# EAGLE design FlightControl (EAGLE 6.5.0)
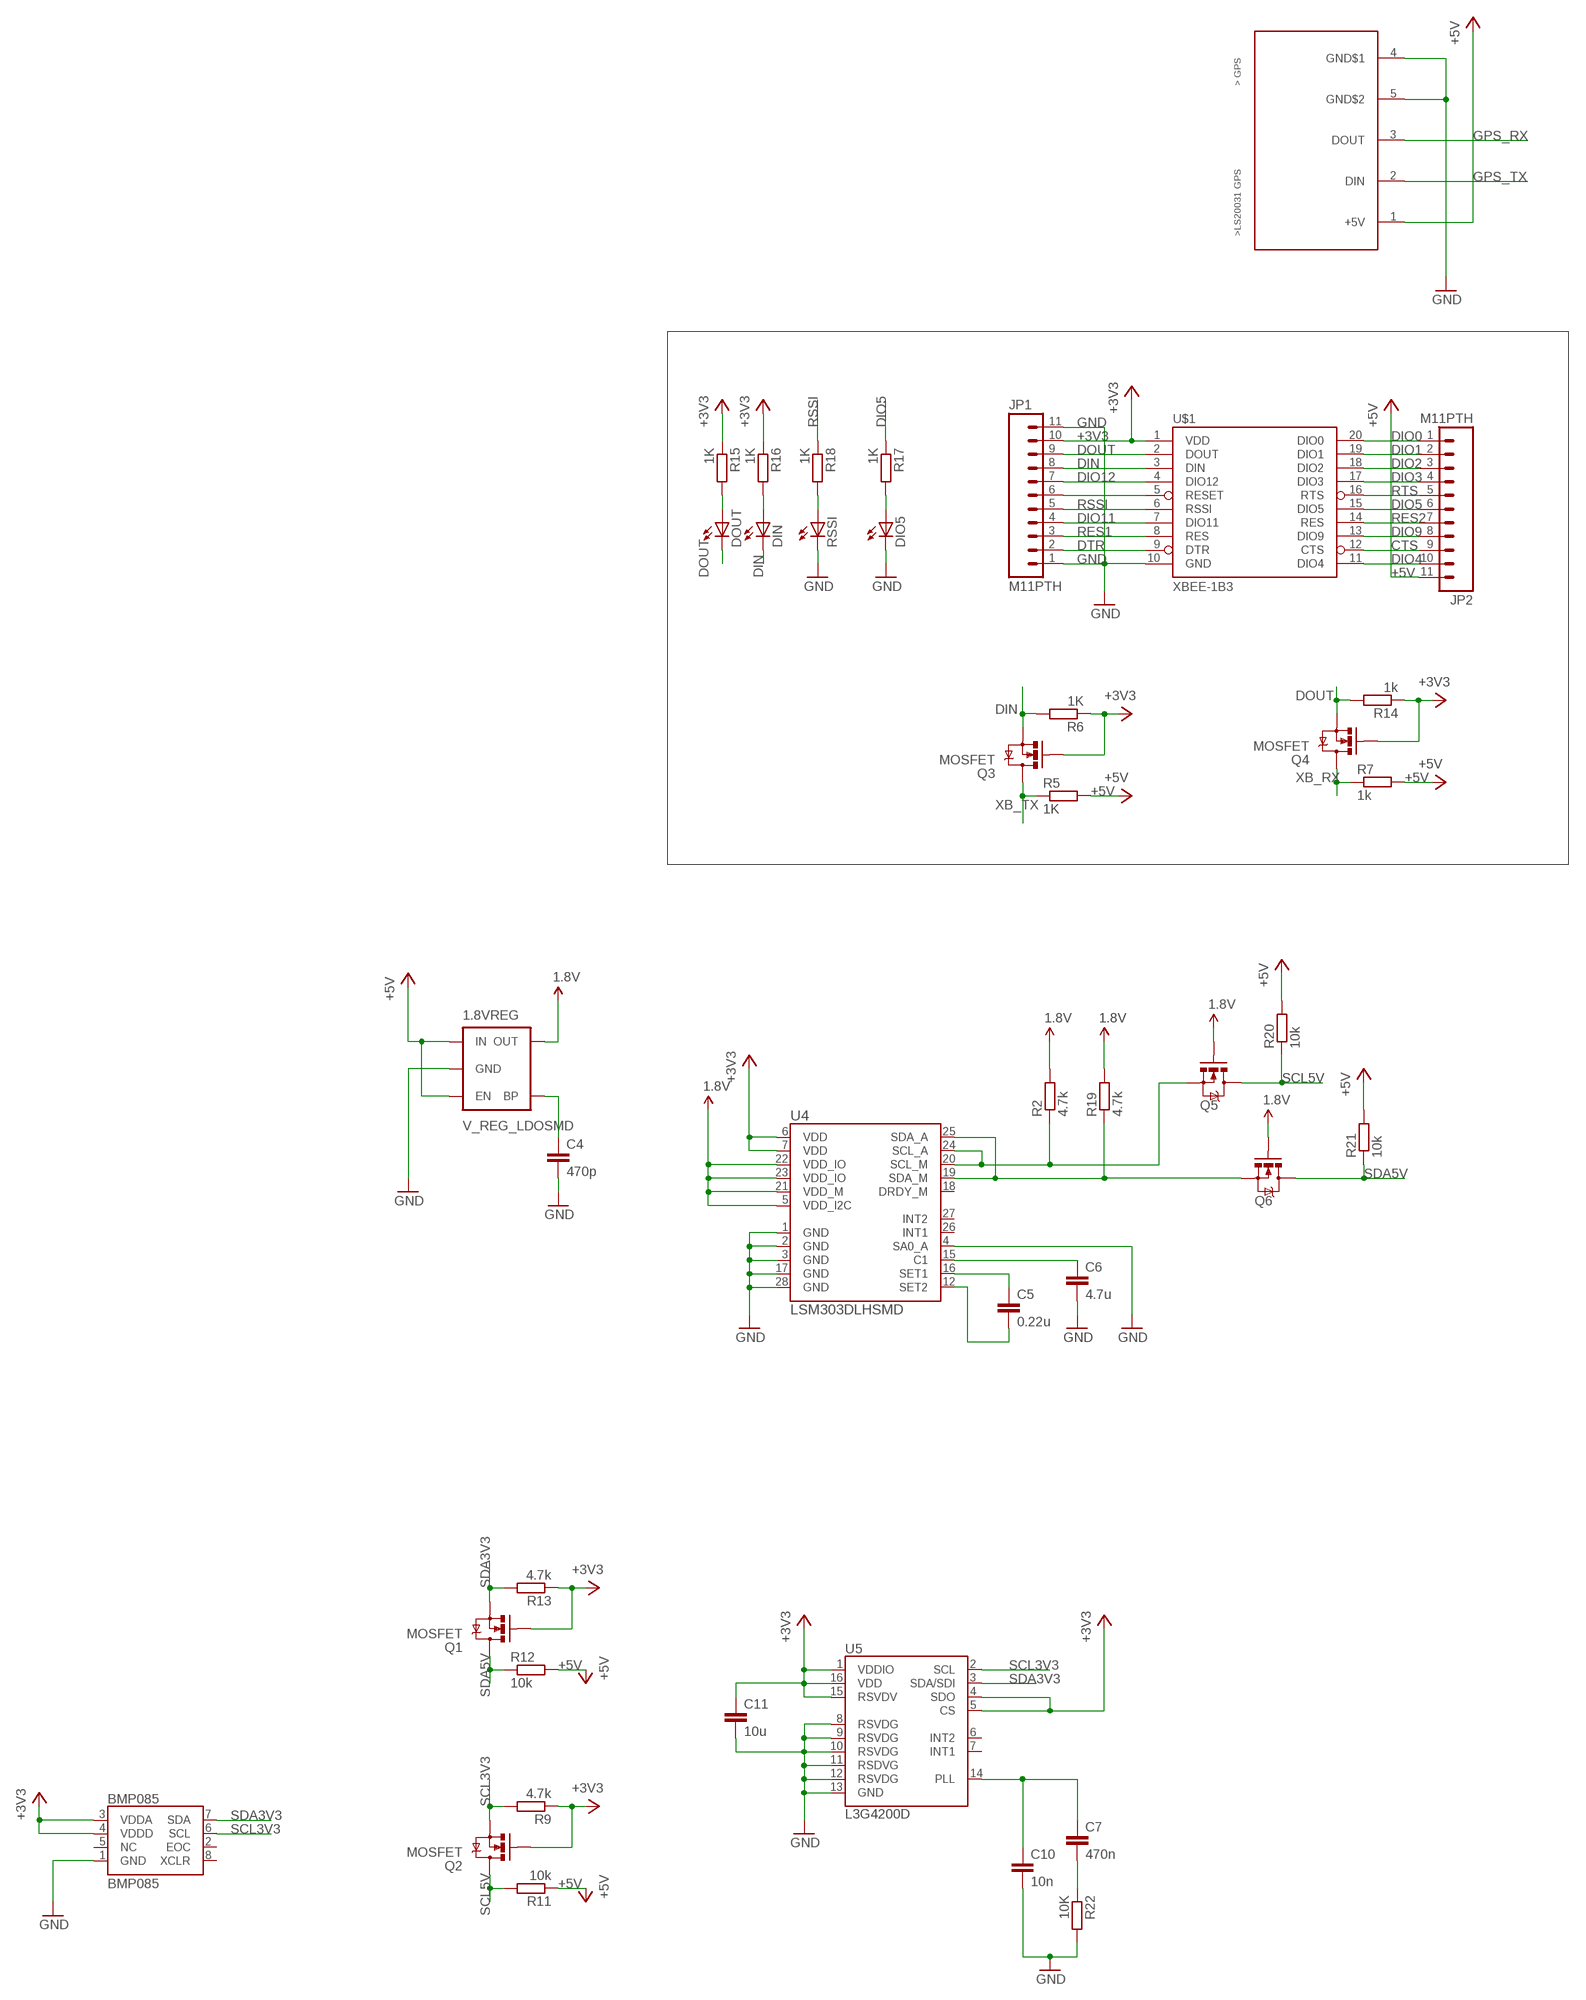
[diagram p0: schematic, sheet 1, part 1 of 2]
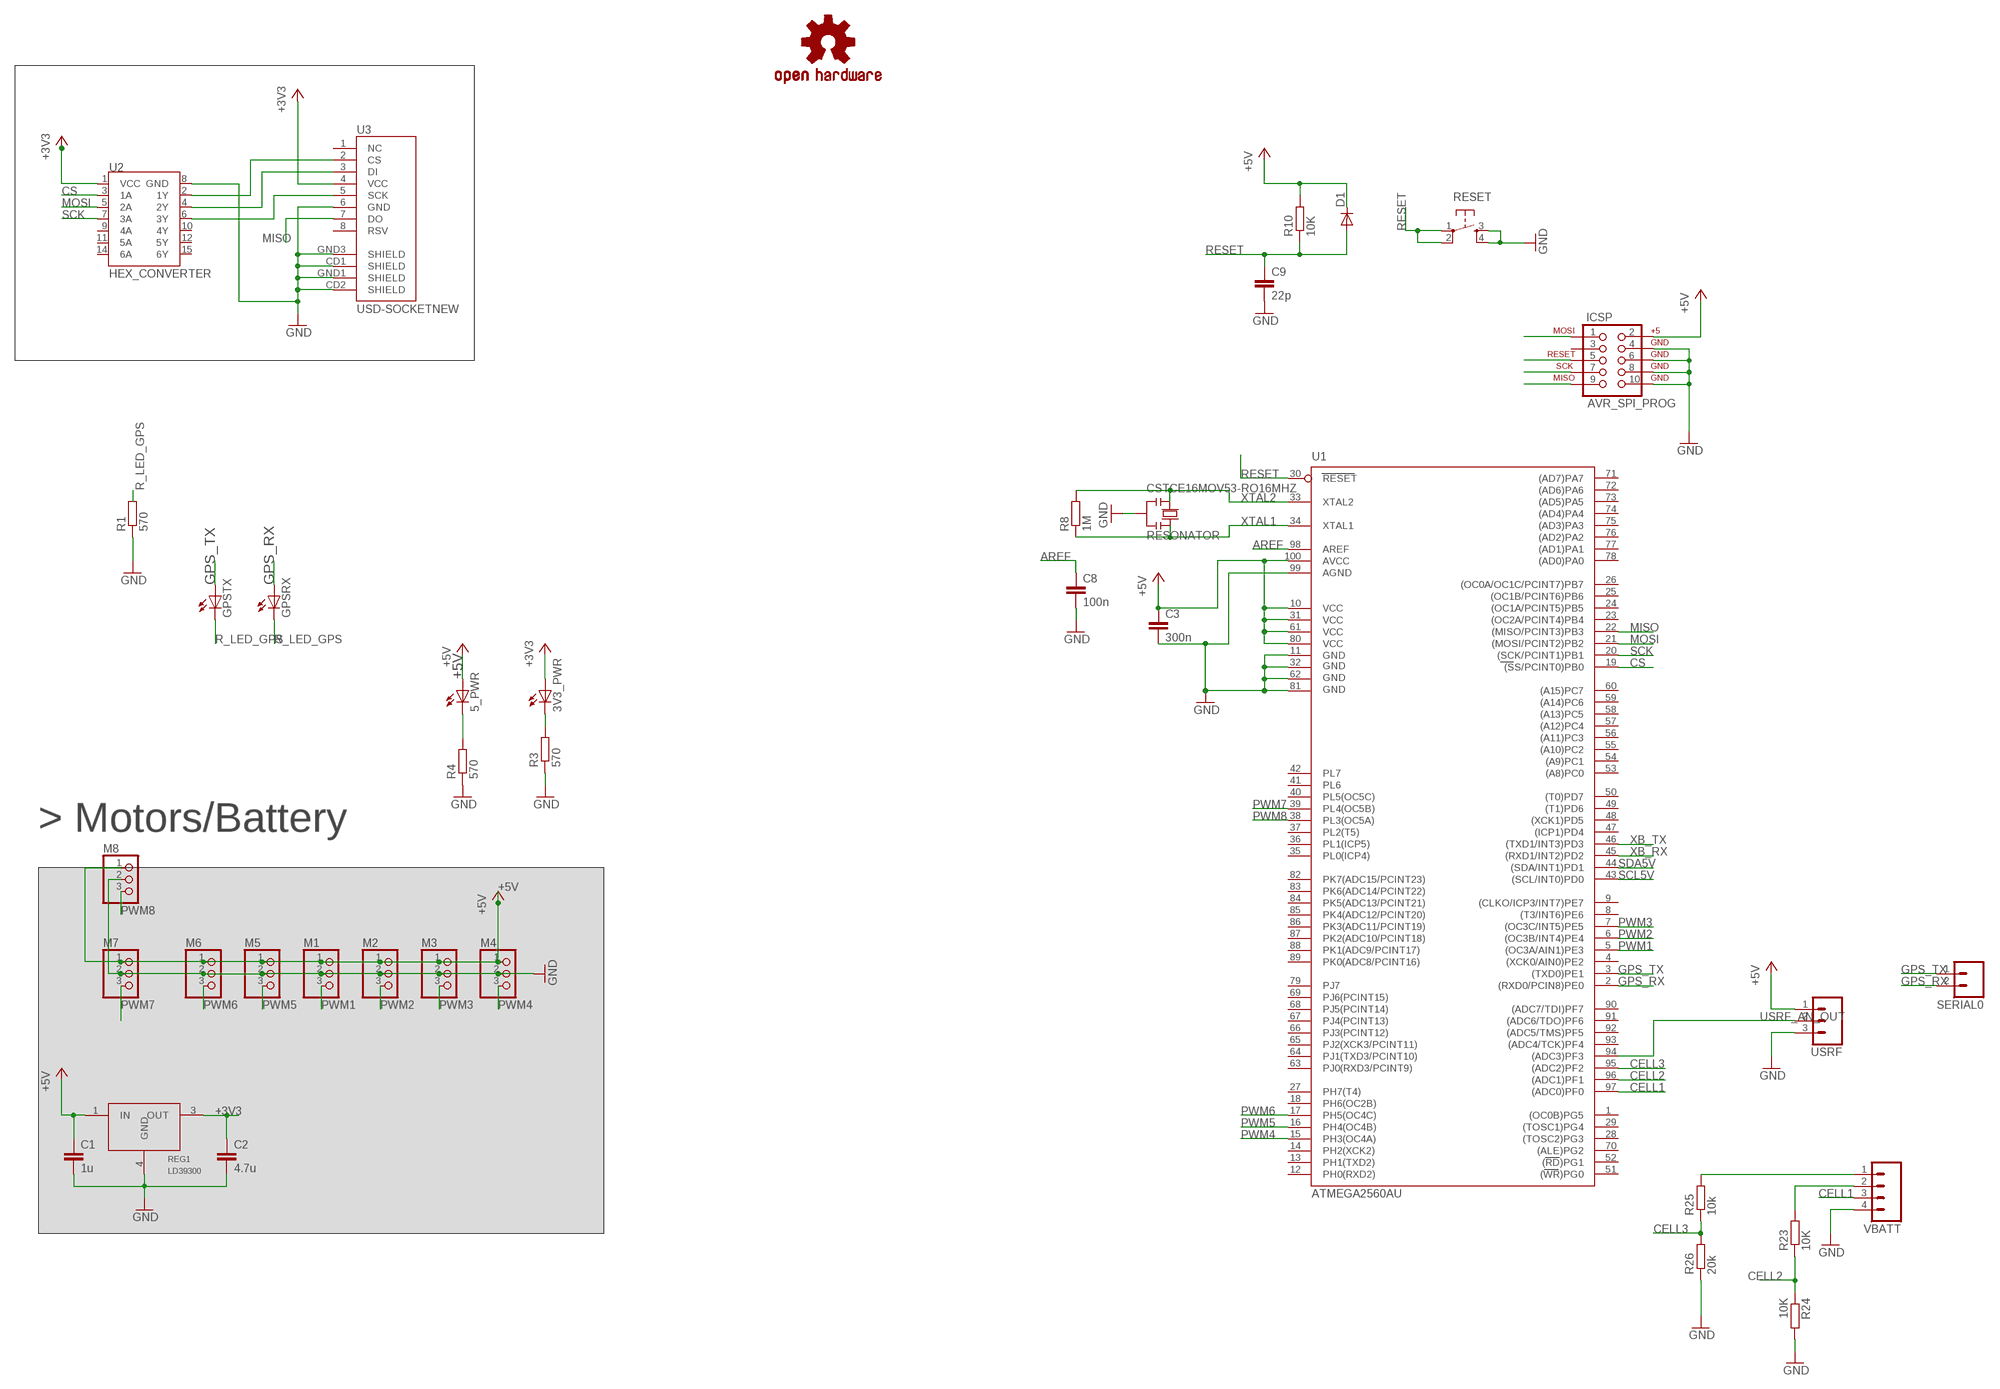
[diagram p1: schematic, sheet 1, part 2 of 2]

## Parts
1.8VREG  V_REG_LDOSMD  [SOT23-5]
3V3_PWR  LEDCHIPLED_1206  [CHIPLED_1206]
5_PWR  LEDCHIPLED_1206  [CHIPLED_1206]
BMP085  BMP085  [BMP085]
C1  1u  C-EUC3216  [C3216]
C2  4.7u  C-EUC3216  [C3216]
C3  300n  C-EUC3216  [C3216]
C4  470p  C-EUC3216  [C3216]
C5  0.22u  C-EUC3216  [C3216]
C6  4.7u  C-EUC3216  [C3216]
C7  470n  C-EUC3216  [C3216]
C8  100n  C-EUC3216  [C3216]
C9  22p  C-EUC3216  [C3216]
C10  10n  C-EUC3216  [C3216]
C11  10u  C-EUC3216  [C3216]
CSTCE16MOV53-RO16MHZ  RESONATOR  RESONATORMU  [RESONATOR]
D1  DIODE-MINIMELF  [MINIMELF]
DIN  LEDCHIPLED_1206  [CHIPLED_1206]
DIO5  LEDCHIPLED_1206  [CHIPLED_1206]
DOUT  LEDCHIPLED_1206  [CHIPLED_1206]
GPSRX  LEDCHIPLED_1206  [CHIPLED_1206]
GPSTX  LEDCHIPLED_1206  [CHIPLED_1206]
ICSP  AVR_SPI_PROG  [AVR_ICSP]
JP1  M11PTH  [1X11]
JP2  M11PTH  [1X11]
LOGO1  OSHW-LOGOL  [OSHW-LOGO-L]
M1  PINHD-1X3  [1X03]
M2  PINHD-1X3  [1X03]
M3  PINHD-1X3  [1X03]
M4  PINHD-1X3  [1X03]
M5  PINHD-1X3  [1X03]
M6  PINHD-1X3  [1X03]
M7  PINHD-1X3  [1X03]
M8  PINHD-1X3  [1X03]
Q1  MOSFET  MOSFET-NCHANNELBSS138  [SOT23]
Q2  MOSFET  MOSFET-NCHANNELBSS138  [SOT23]
Q3  MOSFET  MOSFET-NCHANNELBSS138  [SOT23]
Q4  MOSFET  MOSFET-NCHANNELBSS138  [SOT23]
Q5  MOSFET  MOSFET-NCHANNELBSS138  [SOT23]
Q6  MOSFET  MOSFET-NCHANNELBSS138  [SOT23]
R1  570  R-EU_R1206  [R1206]
R2  4.7k  R-EU_R1206  [R1206]
R3  570  R-EU_R1206  [R1206]
R4  570  R-EU_R1206  [R1206]
R5  1K  R-EU_R1206  [R1206]
R6  1K  R-EU_R1206  [R1206]
R7  1k  R-EU_R1206  [R1206]
R8  1M  R-EU_R1206  [R1206]
R9  4.7k  R-EU_R1206  [R1206]
R10  10K  R-EU_R1206  [R1206]
R11  10k  R-EU_R1206  [R1206]
R12  10k  R-EU_R1206  [R1206]
R13  4.7k  R-EU_R1206  [R1206]
R14  1k  R-EU_R1206  [R1206]
R15  1K  R-EU_R1206  [R1206]
R16  1K  R-EU_R1206  [R1206]
R17  1K  R-EU_R1206  [R1206]
R18  1K  R-EU_R1206  [R1206]
R19  4.7k  R-EU_R1206  [R1206]
R20  10k  R-EU_R1206  [R1206]
R21  10k  R-EU_R1206  [R1206]
R22  10K  R-EU_R1206  [R1206]
R23  10K  R-EU_R1206  [R1206]
R24  10K  R-EU_R1206  [R1206]
R25  10k  R-EU_R1206  [R1206]
R26  20k  R-EU_R1206  [R1206]
REG1  LD39300  [DPAK]
RESET  TAC_SWITCHPTH  [TACTILE-PTH]
RSSI  LEDCHIPLED_1206  [CHIPLED_1206]
SERIAL0  M02LOCK_LONGPADS  [1X02_LOCK_LONGPADS]
U1  ATMEGA2560AU  [TQFP100]
U2  HEX_CONVERTER  [SO016]
U3  USD-SOCKETNEW  [MICRO-SD-SOCKET-PP]
U4  LSM303DLHSMD  [LGA28-5X5]
U5  L3G4200D  [LGA16-4X4]
U$1  XBEE-1B3  [XBEE-SMD]
U$2  LS20031  [LS20031]
USRF  M03LONGPADS  [1X03_LONGPADS]
VBATT  M04LONGPADS  [1X04_LONGPADS]

## Nets
1.8V: 1.8VREG.5(OUT) Q5.1(G) Q6.1(G) R2.2 R19.2 U4.5(VDD_I2C) U4.21(VDD_M) U4.22(VDD_IO) U4.23(VDD_IO)
+3V3: 3V3_PWR.A BMP085.3(VDDA) BMP085.4(VDDD) C2.1 C11.1 JP1.10 Q1.1(G) Q2.1(G) Q3.1(G) Q4.1(G) R6.1 R9.1 R13.1 R14.1 R15.1 R16.1 REG1.3(OUT) U2.1(VCC) U3.4(VCC) U4.6(VDD) U4.7(VDD) U5.1(VDDIO) U5.4(SDO) U5.5(CS) U5.15(RSVDV) U5.16(VDD) U$1.1(VDD)
+5V: 1.8VREG.1(IN) 1.8VREG.3(EN) 5_PWR.A C1.1 C3.1 D1.C ICSP.2 JP2.11 M1.1 M2.1 M3.1 M4.1 M5.1 M6.1 M7.1 M8.1 R5.2 R7.2 R10.2 R11.1 R12.2 R20.2 R21.2 REG1.1(IN) U1.10(VCC) U1.31(VCC1) U1.61(VCC2) U1.80(VCC3) U1.100(AVCC) U$2.1(+5V) USRF.1
AREF: C8.1 U1.98(AREF)
CELL1: U1.97((ADC0)PF0) VBATT.3
CELL2: R23.1 R24.1 U1.96((ADC1)PF1)
CELL3: R25.1 R26.2 U1.95((ADC2)PF2)
CS: U1.19((SS/PCINT0)PB0) U2.3(1A)
CTS: JP2.9 U$1.12(CTS)
DIN: DIN.C JP1.8 Q3.2(S) R6.2 U$1.3(DIN)
DIO0: JP2.1 U$1.20(DIO0)
DIO1: JP2.2 U$1.19(DIO1)
DIO2: JP2.3 U$1.18(DIO2)
DIO3: JP2.4 U$1.17(DIO3)
DIO4: JP2.10 U$1.11(DIO4)
DIO5: JP2.6 R17.1 U$1.15(DIO5)
DIO9: JP2.8 U$1.13(DIO9)
DIO11: JP1.4 U$1.7(DIO11)
DIO12: JP1.7 U$1.4(DIO12)
DOUT: DOUT.C JP1.9 Q4.2(S) R14.2 U$1.2(DOUT)
DTR: JP1.2 U$1.9(DTR)
GND: 1.8VREG.2(GND) BMP085.1(GND) C1.2 C2.2 C3.2 C4.2 C6.2 C8.2 C9.2 C10.2 C11.2 CSTCE16MOV53-RO16MHZ.2 DIO5.C ICSP.4 ICSP.6 ICSP.8 ICSP.10 JP1.1 JP1.11 M1.2 M2.2 M3.2 M4.2 M5.2 M6.2 M7.2 M8.2 R1.1 R3.1 R4.1 R22.2 R24.2 R26.1 REG1.4(GND) RESET.3 RESET.4 RSSI.C U1.11(GND) U1.32(GND1) U1.62(GND2) U1.81(GND3) U1.99(AGND) U2.8(GND) U3.6(GND) U3.CD1(SHIELD) U3.CD2(SHIELD) U3.GND1(SHIELD) U3.GND3(SHIELD) U4.1(GND) U4.2(GND) U4.3(GND) U4.4(SA0_A) U4.17(GND) U4.28(GND) U5.8(RSVDG) U5.9(RSVDG) U5.10(RSVDG) U5.11(RSDVG) U5.12(RSVDG) U5.13(GND) U$1.10(GND) U$2.4(GND$1) U$2.5(GND$2) USRF.3 VBATT.4
GPS_RX: GPSRX.A SERIAL0.2 U1.2((RXD0/PCIN8)PE0) U$2.3(DOUT)
GPS_TX: GPSTX.A SERIAL0.1 U1.3((TXD0)PE1) U$2.2(DIN)
MISO: ICSP.9 U1.22((MISO/PCINT3)PB3) U3.7(DO)
MOSI: ICSP.1 U1.21((MOSI/PCINT2)PB2) U2.5(2A)
N$1: 3V3_PWR.C R3.2
N$2: 1.8VREG.4(BP) C4.1
N$3: U2.2(1Y) U3.2(CS)
N$4: U2.4(2Y) U3.3(DI)
N$5: U2.6(3Y) U3.5(SCK)
N$6: C5.1 U4.16(SET1)
N$7: 5_PWR.C R4.2
N$8: DIO5.A R17.2
N$9: R18.2 RSSI.A
N$10: DIN.A R16.2
N$11: DOUT.A R15.2
N$12: JP1.6 U$1.5(RESET)
N$13: C5.2 U4.12(SET2)
N$14: C6.1 U4.15(C1)
N$16: Q5.2(S) R2.1 U4.20(SCL_M) U4.24(SCL_A)
N$17: Q6.2(S) R19.1 U4.19(SDA_M) U4.25(SDA_A)
N$18: R23.2 VBATT.2
N$19: C7.1 C10.1 U5.14(PLL)
N$20: C7.2 R22.1
N$21: R25.2 VBATT.1
PWM1: M1.3 U1.5((OC3A/AIN1)PE3)
PWM2: M2.3 U1.6((OC3B/INT4)PE4)
PWM3: M3.3 U1.7((OC3C/INT5)PE5)
PWM4: M4.3 U1.15(PH3(OC4A))
PWM5: M5.3 U1.16(PH4(OC4B))
PWM6: M6.3 U1.17(PH5(OC4C))
PWM7: M7.3 U1.39(PL4(OC5B))
PWM8: M8.3 U1.38(PL3(OC5A))
R_LED_GPS: GPSRX.C GPSTX.C R1.2
RES1: JP1.3 U$1.8(RES)
RES2: JP2.7 U$1.14(RES)
RESET: C9.1 D1.A ICSP.5 R10.1 RESET.1 RESET.2 U1.30(RESET)
RSSI: JP1.5 R18.1 U$1.6(RSSI)
RTS: JP2.5 U$1.16(RTS)
SCK: ICSP.7 U1.20((SCK/PCINT1)PB1) U2.7(3A)
SCL3V3: BMP085.6(SCL) Q2.2(S) R9.2 U5.2(SCL)
SCL5V: Q2.3(D) Q5.3(D) R11.2 R20.1 U1.43((SCL/INT0)PD0)
SDA3V3: BMP085.7(SDA) Q1.2(S) R13.2 U5.3(SDA/SDI)
SDA5V: Q1.3(D) Q6.3(D) R12.1 R21.1 U1.44((SDA/INT1)PD1)
USRF_AN_OUT: U1.94((ADC3)PF3) USRF.2
XB_RX: Q4.3(D) R7.1 U1.45((RXD1/INT2)PD2)
XB_TX: Q3.3(D) R5.1 U1.46((TXD1/INT3)PD3)
XTAL1: CSTCE16MOV53-RO16MHZ.3 R8.1 U1.34(XTAL1)
XTAL2: CSTCE16MOV53-RO16MHZ.1 R8.2 U1.33(XTAL2)
Unconnected: BMP085.2(EOC) BMP085.5(NC) BMP085.8(XCLR) ICSP.3 U1.1((OC0B)PG5) U1.4((XCK0/AIN0)PE2) U1.8((T3/INT6)PE6) U1.9((CLKO/ICP3/INT7)PE7) U1.12(PH0(RXD2)) U1.13(PH1(TXD2)) U1.14(PH2(XCK2)) U1.18(PH6(OC2B)) U1.23((OC2A/PCINT4)PB4) U1.24((OC1A/PCINT5)PB5) U1.25((OC1B/PCINT6)PB6) U1.26((OC0A/OC1C/PCINT7)PB7) U1.27(PH7(T4)) U1.28((TOSC2)PG3) U1.29((TOSC1)PG4) U1.35(PL0(ICP4)) U1.36(PL1(ICP5)) U1.37(PL2(T5)) U1.40(PL5(OC5C)) U1.41(PL6) U1.42(PL7) U1.47((ICP1)PD4) U1.48((XCK1)PD5) U1.49((T1)PD6) U1.50((T0)PD7) U1.51((WR)PG0) U1.52((RD)PG1) U1.53((A8)PC0) U1.54((A9)PC1) U1.55((A10)PC2) U1.56((A11)PC3) U1.57((A12)PC4) U1.58((A13)PC5) U1.59((A14)PC6) U1.60((A15)PC7) U1.63(PJ0(RXD3/PCINT9)) U1.64(PJ1(TXD3/PCINT10)) U1.65(PJ2(XCK3/PCINT11)) U1.66(PJ3(PCINT12)) U1.67(PJ4(PCINT13)) U1.68(PJ5(PCINT14)) U1.69(PJ6(PCINT15)) U1.70((ALE)PG2) U1.71((AD7)PA7) U1.72((AD6)PA6) U1.73((AD5)PA5) U1.74((AD4)PA4) U1.75((AD3)PA3) U1.76((AD2)PA2) U1.77((AD1)PA1) U1.78((AD0)PA0) U1.79(PJ7) U1.82(PK7(ADC15/PCINT23)) U1.83(PK6(ADC14/PCINT22)) U1.84(PK5(ADC13/PCINT21)) U1.85(PK4(ADC12/PCINT20)) U1.86(PK3(ADC11/PCINT19)) U1.87(PK2(ADC10/PCINT18)) U1.88(PK1(ADC9/PCINT17)) U1.89(PK0(ADC8/PCINT16)) U1.90((ADC7/TDI)PF7) U1.91((ADC6/TDO)PF6) U1.92((ADC5/TMS)PF5) U1.93((ADC4/TCK)PF4) U2.9(4A) U2.10(4Y) U2.11(5A) U2.12(5Y) U2.14(6A) U2.15(6Y) U3.1(NC) U3.8(RSV) U4.18(DRDY_M) U4.26(INT1) U4.27(INT2) U5.6(INT2) U5.7(INT1)

## Notes on the sheet
- > Motors/Battery

## Library data of the parts
1.8VREG = SparkFun-PowerIC:V_REG_LDO: Voltage Regulator LDO Standard 150mA LDO voltage regulator in SOT-23 layout. Micrel part MIC5205. BP (by-pass) pin is used to lower output noise with 470pF cap.
3V3_PWR 5_PWR DIN DIO5 DOUT GPSRX GPSTX RSSI = adafruit:LED: LED OSRAM: - CHIPLED LG R971, LG N971, LY N971, LG Q971, LY Q971, LO R971, LY R971 LH N974, LH R974 LS Q976, LO Q976, LY Q976 LO Q996 - Hyper CHIPLED LW Q18S LB Q993, LB Q99A, LB R99A - SideLED LS A670, LO A670, LY A670, LG A670, LP A670 LB A673, LV A673, LT A673, LW A673 LH A674 LY A675 LS A676, LA A676, LO A676, LY A676, LW A676 LS A679, LY A679, LG A679 - Hyper Micro SIDELED® LS Y876, LA Y876, LO Y876, LY Y876 LT Y87S - SmartLED LW L88C, LW L88S LB L89C, LB L89S, LG L890 LS L89K, LO L89K, LY L89K LS L896, LA L896, LO L896, LY L896 - TOPLED LS T670, LO T670, LY T670, LG T670, LP T670 LSG T670, LSP T670, LSY T670, LOP T670, LYG T670 LG T671, LOG T671, LSG T671 LB T673, LV T673, LT T673, LW T673 LH T674 LS T676, LA T676, LO T676, LY T676, LB T676, LH T676, LSB T676, LW T676 LB T67C, LV T67C, LT T67C, LS T67K, LO T67K, LY T67K, LW E67C LS E67B, LA E67B, LO E67B, LY E67B, LB E67C, LV E67C, LT E67C LW T67C LS T679, LY T679, LG T679 LS T770, LO T770, LY T770, LG T770, LP T770 LB T773, LV T773, LT T773, LW T773 LH T774 LS E675, LA E675, LY E675, LS T675 LS T776, LA T776, LO T776, LY T776, LB T776 LHGB T686 LT T68C, LB T68C - Hyper Mini TOPLED® LB M676 - Mini TOPLED Santana® LG M470 LS M47K, LO M47K, LY M47K Source: http://www.osram.convergy.de/
BMP085 = SparkFun:BMP085: BMP085 Pressure Sensor Great little MEMS pressure sensor. SKU: COM-09603
C1-C11 = rcl:C-EU: CAPACITOR, European symbol
CSTCE16MOV53-RO16MHZ = SmartPrj:RESONATOR
D1 = diode:DIODE-: DIODE
ICSP = SparkFun-Connectors:AVR_SPI_PROG: AVR 10-pin ICSP Header This is the standard AVR In Circuit Serial Programming header. Minimal, but includes pin one indicator. Works with standard Olimex programmers. Also look for the 6-pin reduced version. Spark Fun Electronics SKU: PRT-00778
JP1 JP2 = SparkFun-Connectors:M11: Header 11 Standard 11-pin 0.1" header. Use with straight break away headers (SKU : PRT-00116), right angle break away headers (PRT-00553), swiss pins (PRT-00743), machine pins (PRT-00117), and female headers (PRT-00115).
LOGO1 = SparkFun-Aesthetics:OSHW-LOGO: Open Source Hardware Logo This logo indicates the piece of hardware it is found on incorporates a OSHW license and/or adheres to the definition of open source hardware found here: http://freedomdefined.org/OSHW
M1-M8 = pinhead:PINHD-1X3: PIN HEADER
Q1-Q6 = SparkFun-DiscreteSemi:MOSFET-NCHANNEL: Common NMOSFET Parts MFG P/N Store ID Prod ID FDD8780 TRANS-09984 SI7820DN TRANS-11055 FDS6630A IC-08089 2N7002PW TRANS-11151 FQP30N06L COM-10213 TRANS-10060 BSS123LT1G TRANS-08345 BSS138 TRANS-00830 BS170 2N7000; PROD_ID: TRANS-00830
R1-R26 = SmartPrj:R-EU_: RESISTOR, European symbol
REG1 = v-reg:LD39300
RESET = SparkFun-Electromechanical:TAC_SWITCH: Momentary Switch Button commonly used for reset or general input. Spark Fun Electronics SKU : COM-00097 SMT- SWCH-08247
SERIAL0 = SparkFun-Connectors:M02: Standard 2-pin 0.1" header. Use with - straight break away headers ( PRT-00116) - right angle break away headers (PRT-00553) - swiss pins (PRT-00743) - machine pins (PRT-00117) - female headers (PRT-00115) Molex polarized connector foot print use with: PRT-08233 with associated crimp pins and housings. 2.54_SCREWTERM for use with PRT-10571. 3.5mm Screw Terminal footprints for PRT-08084 5mm Screw Terminal footprints for use with PRT-08433
U1 = SparkFun-DigitalIC:ATMEGA2560: Atmel 100-pin 8-bit uC 64/128/256 Kbytes FLASH 4 Kbytes EEPROM 8 Kbytes SRAM 86 General Purpose I/O pins 12-channels16-bit PWM 4 x Serial USARTs 16-channels 10-bit A/D
U2 = SparkFun-DigitalIC:HEX_CONVERTER: Just what it says.
U3 = SparkFun-Connectors:USD-SOCKET: microSD Socket Push-push type uSD socket. Schematic element and footprint production proven. Spark Fun Electronics SKU : PRT-00127. tDoc lines correctly indicate media card edge positions when inserting (unlocked, locked, depressed).
U4 = SparkFun-Sensors:LSM303DLH: I2C accelerometer/magnetometer/tilt compensated compass
U5 = SparkFun-Sensors:L3G4200D: L3G4200D Three-axis, digital output gyroscope The L3G4200D is a low-power three-axis angular rate sensor, has a full scale of ±250/±500/±2000 dps and is capable of measuring rates with a user-selectable bandwidth. It includes a sensing element and an IC interface capable of providing the measured angular rate to the external world through a digital interface (I2C/SPI). Package: 4x4x1.1 LGA-16 (LGA16-4x4.PAC)
U$1 = SparkFun-RF:XBEE-1: Xbee module footprints SMT header is CONN-09042.; PROD_ID: CONN-09042
U$2 = MyLib:LS20031
USRF = SparkFun-Connectors:M03: Header 3 Standard 3-pin 0.1" header. Use with straight break away headers (SKU : PRT-00116), right angle break away headers (PRT-00553), swiss pins (PRT-00743), machine pins (PRT-00117), and female headers (PRT-00115). Molex polarized connector foot print use with SKU : PRT-08232 with associated crimp pins and housings.
VBATT = SparkFun-Connectors:M04: Header 4 Standard 4-pin 0.1" header. Use with straight break away headers (SKU : PRT-00116), right angle break away headers (PRT-00553), swiss pins (PRT-00743), machine pins (PRT-00117), and female headers (PRT-00115). Molex polarized connector foot print use with SKU : PRT-08231 with associated crimp pins and housings. 1MM SMD Version SKU: PRT-10208

## Net classes
0 default: clearance 0.205 mm

## Board
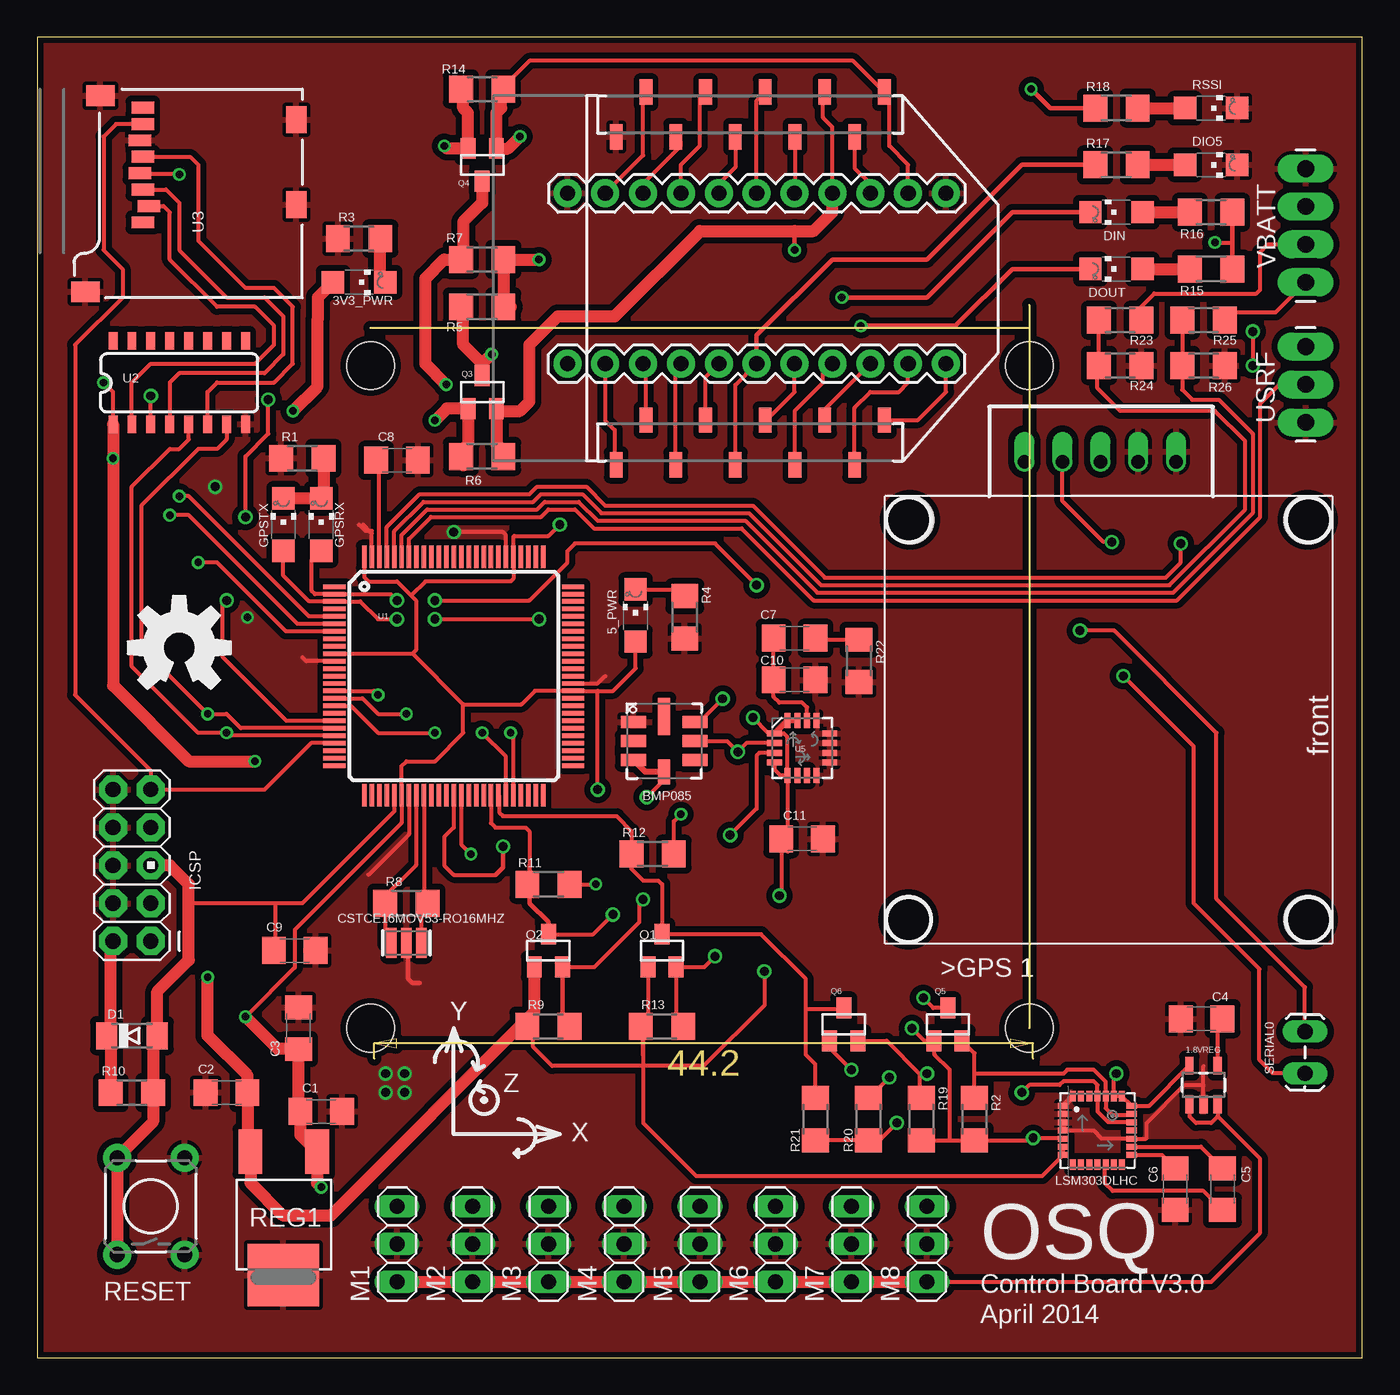
[diagram p2: board, top side]
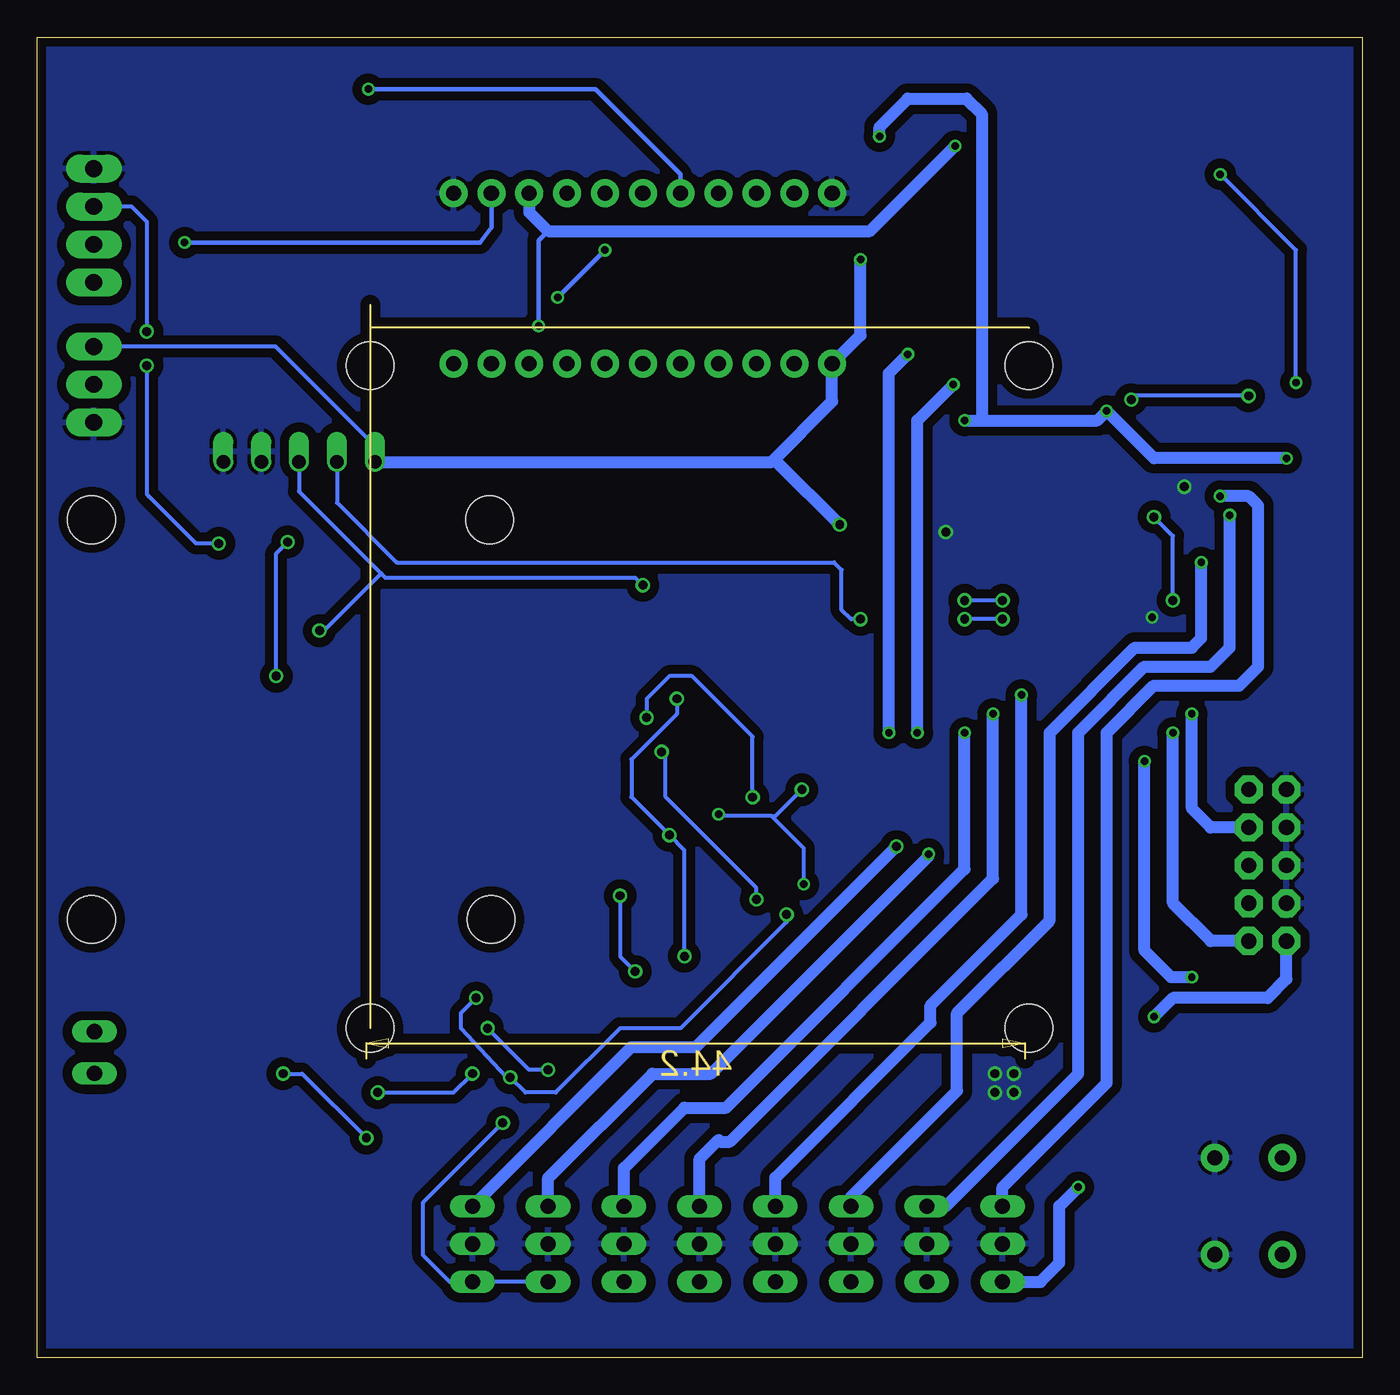
[diagram p3: board, bottom side, seen from below]

Size 88.88 x 88.57 mm. Coordinates in mm from the lower left corner, seen from the top.
Outline: 0,0 88.88,0 88.88,88.57 0,88.57 0,0
Copper layers (1*16): Top 0.0356mm / dielectric 1.5011mm / Bottom 0.0356mm
Design rules "designRules": minimum track width 6mil, minimum drill 13mil, track to track 6mil, track to pad 6mil, pad to pad 6mil, via to via 6mil, smd to smd 6mil, copper to edge 15mil, drill to drill 6mil, minimum pad ring 7mil, minimum via ring 7mil, stop-mask expansion 3mil, vias tented up to drill 0mil, thermal gap 10mil
Holes 3.2 mm at 22.35,66.55 66.55,66.55 66.55,22.1 22.35,22.1 58.44,29.4 85.24,29.4 85.24,56.2 58.54,56.2 -29.97,55.63

### Footprints (pad centres in the part's own frame; a part is rotated, then mirrored left to right if it is on the bottom)
SOT23-5 = smd 0.55 x 1.2: 1 -0.95,-1.3; 2 0,-1.3; 3 0.95,-1.3; 4 0.95,1.3; 5 -0.95,1.3
CHIPLED_1206 = smd 1.5 x 1.5: A 0,-1.75; C 0,1.75
BMP085 = smd 1.67 x 0.8: 1 -2.065,1.27; 2 -2.065,0; 3 -2.065,-1.27; 5 2.065,-1.27; 6 2.065,0; 7 2.065,1.27 | smd 0.8 x 1.67: 4 0,-2.065 | smd 0.8 x 2.5: 8 0,1.65
C3216 = smd 1.6 x 1.8: 1 -1.4,0; 2 1.4,0
RESONATOR = smd 0.7 x 2: 1 -1,0; 2 0,0; 3 1,0
MINIMELF = smd 1.4 x 1.8: A 1.7,0; C -1.7,0
AVR_ICSP = drill 1.016 pad 1.88 octagon: 1 -1.27,5.08; 2 1.27,5.08; 3 -1.27,2.54; 4 1.27,2.54; 5 -1.27,0; 6 1.27,0; 7 -1.27,-2.54; 8 1.27,-2.54; 9 -1.27,-5.08; 10 1.27,-5.08
1X11 = drill 1.016 pad 1.88: 1 0,0; 2 2.54,0; 3 5.08,0; 4 7.62,0; 5 10.16,0; 6 12.7,0; 7 15.24,0; 8 17.78,0; 9 20.32,0; 10 22.86,0; 11 25.4,0
1X03 = drill 1.016 long: 1 -2.54,0; 2 0,0; 3 2.54,0
SOT23 = smd 1 x 1.4: 1 -0.95,-1.1; 2 0.95,-1.1; 3 0,1.1
R1206 = smd 1.6 x 1.803: 1 -1.422,0; 2 1.422,0
DPAK = smd 1.6 x 2.997: 1 -2.261,-4.928; 3 2.21,-4.928 | smd 4.826 x 4.191: 4 0,3.353
TACTILE-PTH = drill 1.016 pad 1.88: 1 -3.251,2.261; 2 3.251,2.261; 3 -3.251,-2.261; 4 3.251,-2.261
1X02_LOCK_LONGPADS = drill 1.016 long: 1 -0.127,0; 2 2.667,0
TQFP100 = smd 1.5 x 0.3: 1 -8,6; 2 -8,5.5; 3 -8,5; 4 -8,4.5; 5 -8,4; 6 -8,3.5; 7 -8,3; 8 -8,2.5; 9 -8,2; 10 -8,1.5; 11 -8,1; 12 -8,0.5; 13 -8,0; 14 -8,-0.5; 15 -8,-1; 16 -8,-1.5; 17 -8,-2; 18 -8,-2.5; 19 -8,-3; 20 -8,-3.5; 21 -8,-4; 22 -8,-4.5; 23 -8,-5; 24 -8,-5.5; 25 -8,-6; 51 8,-6; 52 8,-5.5; 53 8,-5; 54 8,-4.5; 55 8,-4; 56 8,-3.5; 57 8,-3; 58 8,-2.5; 59 8,-2; 60 8,-1.5; 61 8,-1; 62 8,-0.5; 63 8,0; 64 8,0.5; 65 8,1; 66 8,1.5; 67 8,2; 68 8,2.5; 69 8,3; 70 8,3.5; 71 8,4; 72 8,4.5; 73 8,5; 74 8,5.5; 75 8,6 | smd 0.3 x 1.5: 26 -6,-8; 27 -5.5,-8; 28 -5,-8; 29 -4.5,-8; 30 -4,-8; 31 -3.5,-8; 32 -3,-8; 33 -2.5,-8; 34 -2,-8; 35 -1.5,-8; 36 -1,-8; 37 -0.5,-8; 38 0,-8; 39 0.5,-8; 40 1,-8; 41 1.5,-8; 42 2,-8; 43 2.5,-8; 44 3,-8; 45 3.5,-8; 46 4,-8; 47 4.5,-8; 48 5,-8; 49 5.5,-8; 50 6,-8; 76 6,8; 77 5.5,8; 78 5,8; 79 4.5,8; 80 4,8; 81 3.5,8; 82 3,8; 83 2.5,8; 84 2,8; 85 1.5,8; 86 1,8; 87 0.5,8; 88 0,8; 89 -0.5,8; 90 -1,8; 91 -1.5,8; 92 -2,8; 93 -2.5,8; 94 -3,8; 95 -3.5,8; 96 -4,8; 97 -4.5,8; 98 -5,8; 99 -5.5,8; 100 -6,8
SO016 = smd 0.6 x 1.2: 1 -4.445,-2.8; 2 -3.175,-2.8; 3 -1.905,-2.8; 4 -0.635,-2.8; 5 0.635,-2.8; 6 1.905,-2.8; 7 3.175,-2.8; 8 4.445,-2.8; 9 4.445,2.8; 10 3.175,2.8; 11 1.905,2.8; 12 0.635,2.8; 13 -0.635,2.8; 14 -1.905,2.8; 15 -3.175,2.8; 16 -4.445,2.8
MICRO-SD-SOCKET-PP = smd 0.8 x 1.5: 1 -8.94,10.7; 2 -7.84,10.3; 3 -6.74,10.7; 4 -5.64,10.9; 5 -4.54,10.7; 6 -3.44,10.9; 7 -2.34,10.7; 8 -1.24,10.7 | smd 1.8 x 1.4: CD1 -2.05,0.4; CD2 -7.75,0.4 | smd 1.4 x 1.9: GND1 -13.6,14.55; GND3 -0.45,13.55
LGA28-5X5 = smd 0.7 x 0.4: 1 -2.3,1.65; 2 -2.3,1.1; 3 -2.3,0.55; 4 -2.3,0; 5 -2.3,-0.55; 6 -2.3,-1.1; 7 -2.3,-1.65; 15 2.3,-1.65; 16 2.3,-1.1; 17 2.3,-0.55; 18 2.3,0; 19 2.3,0.55; 20 2.3,1.1; 21 2.3,1.65 | smd 0.4 x 0.7: 8 -1.65,-2.3; 9 -1.1,-2.3; 10 -0.55,-2.3; 11 0,-2.3; 12 0.55,-2.3; 13 1.1,-2.3; 14 1.65,-2.3; 22 1.65,2.3; 23 1.1,2.3; 24 0.55,2.3; 25 0,2.3; 26 -0.55,2.3; 27 -1.1,2.3; 28 -1.65,2.3
LGA16-4X4 = smd 1 x 0.4: 1 -1.85,0.975; 2 -1.85,0.325; 3 -1.85,-0.325; 4 -1.85,-0.975; 9 1.85,-0.975; 10 1.85,-0.325; 11 1.85,0.325; 12 1.85,0.975 | smd 0.4 x 1: 5 -0.975,-1.85; 6 -0.325,-1.85; 7 0.325,-1.85; 8 0.975,-1.85; 13 0.975,1.85; 14 0.325,1.85; 15 -0.325,1.85; 16 -0.975,1.85
XBEE-SMD = smd 1.7 x 0.85: 1 -12.5,20; 2 -9.5,18; 3 -12.5,16; 4 -9.5,14; 5 -12.5,12; 6 -9.5,10; 7 -12.5,8; 8 -9.5,6; 9 -12.5,4; 10 -9.5,2; 11 12.5,2; 12 9.5,4; 13 12.5,6; 14 9.5,8; 15 12.5,10; 16 9.5,12; 17 12.5,14; 18 9.5,16; 19 12.5,18; 20 9.5,20
LS20031 = drill 0.9 offset: 1 20.65,-2.3; 2 18.09,-2.31; 3 15.55,-2.31; 4 13.01,-2.31; 5 10.47,-2.31
1X03_LONGPADS = drill 1.118 pad 1.88 long: 1 0,0; 2 2.54,0; 3 5.08,0
1X04_LONGPADS = drill 1.118 pad 1.88 long: 1 0,0; 2 2.54,0; 3 5.08,0; 4 7.62,0

### Placement (x,y rotation side)
1.8VREG  78.23,18.29 0 top
3V3_PWR  21.59,72.14 270 top
5_PWR  40.13,49.78 0 top
BMP085  42.06,41.36 0 top
C1  19.05,16.51 0 top
C2  12.7,17.78 180 top
C3  17.53,22.1 90 top
C4  78.11,22.73 180 top
C5  79.5,11.3 270 top
C6  76.33,11.3 270 top
C7  50.8,48.26 0 top
C8  24.13,60.2 0 top
C9  17.27,27.3 0 top
C10  50.8,45.47 0 top
C11  51.31,34.8 0 top
CSTCE16MOV53-RO16MHZ  24.77,27.81 0 top
D1  6.35,21.59 0 top
DIN  72.39,76.83 90 top
DIO5  78.74,80.01 270 top
DOUT  72.39,73.03 90 top
GPSRX  19.05,55.88 0 top
GPSTX  16.51,55.88 0 top
ICSP  6.35,33.02 180 top
JP1  35.56,78.11 0 top
JP2  60.96,66.67 180 top
LOGO1  9.53,47.62 0 top
M1  24.13,7.62 90 top
M2  29.21,7.62 90 top
M3  34.29,7.62 90 top
M4  39.37,7.62 90 top
M5  44.45,7.62 90 top
M6  49.53,7.62 90 top
M7  54.61,7.62 90 top
M8  59.69,7.62 90 top
Q1  41.91,27.3 0 top
Q2  34.29,27.3 0 top
Q3  29.84,64.77 0 top
Q4  29.84,80.01 180 top
Q5  61.09,22.35 0 top
Q6  54.1,22.35 0 top
R1  17.78,60.33 0 top
R2  62.87,16 270 top
R3  21.59,75.06 0 top
R4  43.43,49.66 90 top
R5  29.84,70.48 0 top
R6  29.84,60.45 0 top
R7  29.84,73.66 0 top
R8  24.77,30.48 180 top
R9  34.29,22.23 0 top
R10  6.35,17.78 180 top
R11  34.29,31.75 180 top
R12  41.27,33.78 0 top
R13  41.91,22.23 0 top
R14  29.84,85.09 180 top
R15  78.74,73.03 180 top
R16  78.74,76.83 180 top
R17  72.39,80.01 0 top
R18  72.39,83.82 0 top
R19  59.31,16 270 top
R20  55.75,16 270 top
R21  52.2,16 270 top
R22  55.12,46.74 270 top
R23  72.64,69.6 0 top
R24  72.64,66.55 0 top
R25  78.23,69.6 0 top
R26  78.23,66.55 180 top
REG1  16.51,8.89 180 top
RESET  7.62,10.16 90 top
RSSI  78.74,83.82 270 top
SERIAL0  85.04,19.2 90 top
U1  27.94,45.72 0 top
U2  9.53,65.41 0 top
U3  17.78,85.09 90 top
U4  71.12,15.24 0 top
U5  51.31,40.89 0 top
U$1  36.83,72.39 270 top
U$2  86.87,57.78 180 top
USRF  85.09,67.82 270 top
VBATT  85.09,72.14 90 top

### Tracks (layer width: path | path; a pad name or v marks a point on that pad's centre or on a via)
1.8V  (via drill 0.6)
  Top 0.254: 1.8VREG.5 74.58,16.89 U4.21 U4.22 U4.23 72.22,18.88 v72.39,19.05 | U4.5 68.78,14.73 v66.8,14.73 66.65,14.58 R2.2 61.21,14.58 | R19.2 61.21,14.58 | 61.21,14.58 61.21,19.3 60.2,20.32 60.2,21.19 Q5.1 59.52,21.25 v58.67,22.1 | Q6.1 53.15,20.76 v54.61,19.3
  Bottom 0.254: v72.39,19.05 71.12,19.05 v66.8,14.73 | v54.61,19.3 55.88,19.3 v58.67,22.1
+3V3  (via drill 0.5, 0.6)
  Top 0.254: U2.1 5.08,64.77 v4.45,65.41 | v9.53,79.38 6.96,79.38 U3.4 | JP1.10 58.42,80.01 57.15,81.28 57.15,84.57 U$1.1 54.73,87 33.02,87 31.27,85.24 R14.1 | 40.64,20.32 40.64,19.56 | 40.64,19.56 40.64,15.75 44.2,12.19 67.42,12.19 U4.7 U4.6 | U5.5 50.33,33.95 C11.1 49.91,31.11 v49.78,30.99 | U5.5 50.29,39.09 50.29,41.66 50.08,41.87 U5.1 49.06,41.87 v48.01,42.93 | v48.77,25.91 48.77,23.62 44.7,19.56 40.64,19.56 | 40.64,19.56 34.54,19.56 33.27,20.83 33.27,21.82 R9.1 | Q1.1 40.96,22.7 R13.1 | v78.99,74.8 80.16,74.8 80.16,74.93 | BMP085.4 42.06,38.75 v40.89,37.59 | U5.4 49.46,39.44 49.86,39.04 U5.5
  Top 0.305: R16.1 80.16,74.93 R15.1 | Q2.1 33.34,22.7 R9.1 | 40.64,20.32 40.64,22.07 R13.1
  Top 0.406: U5.15 U5.16 U5.1 | BMP085.4 40.79,39.3 BMP085.3
  Top 0.813: v11.43,25.53 11.43,21.59 14.1,18.92 C2.1 14.1,14.02 REG1.3 14.3,11.73 16.51,9.53 19.68,9.53 33.34,23.18 Q2.1 | v14.61,40.01 10.16,40.01 5.08,45.09 v5.08,60.33 U2.1 | R6.1 28.57,59.84 28.57,60.96 28.89,61.28 Q3.1 27.48,63.67 v26.67,62.87 | R14.1 31.11,84.94 31.11,83.82 30.8,83.5 Q4.1 31.58,81.11 v32.38,81.92 | v17.14,63.5 18.8,65.15 18.8,69.6 18.82,71.12 3V3_PWR.A
  Bottom 0.254: v4.45,65.41 4.45,74.3 v9.53,79.38 | v49.78,30.99 49.78,26.92 v48.77,25.91 | v40.89,37.59 40.89,41.66 44.96,45.72 46.48,45.72 48.01,44.2 v48.01,42.93
  Bottom 0.305: JP1.10 58.42,75.82 59.18,74.8 v78.99,74.8
  Bottom 0.813: v14.61,40.01 14.61,27.3 12.83,25.53 v11.43,25.53 | v5.08,60.33 13.97,60.33 v17.14,63.5 17.78,62.87 25.53,62.87 | v26.67,62.87 25.53,62.87 | v32.38,81.92 32.38,82.55 30.48,84.45 26.54,84.45 25.53,83.44 25.53,62.87
+5V  (via drill 0.5, 0.6)
  Top 0.254: 28.57,43.81 28.57,41.91 26.67,40.01 24.77,40.01 24.44,39.68 U1.31 24.44,35.87 17.27,28.7 17.27,26.16 v13.97,22.86 | 28.57,43.81 25.17,47.22 | U1.10 25.17,47.22 | R11.1 v37.47,31.75 | 42.7,33.17 R12.2 42.7,35.97 v43.18,36.45 | U1.100 21.94,52.35 22.23,52.07 24.13,52.07 25.08,51.12 | 25.08,51.12 25.4,50.8 25.4,47.45 25.17,47.22 | 25.08,51.12 26.04,52.07 31.75,52.07 31.94,52.26 U1.80 31.94,55.05 32,55.12 34.29,55.12 v35.05,55.88 | 28.57,43.81 32.48,43.81 33.38,44.72 U1.61 37.59,44.72 | 1.8VREG.3 79.18,16.19 | 79.18,16.19 78.74,15.75 77.72,15.75 77.28,16.19 1.8VREG.1 | M8.1 78.74,5.08 82.04,8.38 82.04,13.33 79.18,16.19 | v57.66,15.75 56.49,14.58 R20.2 R21.2 | 37.59,44.72 38.62,44.72 40.13,46.23 5_PWR.A | v37.59,38.1 37.59,44.72
  Top 0.813: D1.C 4.93,21.59 | 4.93,21.59 R10.2 | M1.1 M2.1 M3.1 M4.1 M5.1 M6.1 M7.1 M8.1 | 4.93,21.59 4.93,27.79 ICSP.2 | 31.75,70.48 R5.2 R7.2 v33.66,73.66 | v19.05,11.43 18.77,11.71 REG1.1 17.65,14.94 C1.1 17.53,16.63 C3.1 16.13,20.7 v13.97,22.86
  Bottom 0.254: M7.1 M8.1 61.21,5.08 62.99,6.86 62.99,10.41 v57.66,15.75 | v37.47,31.75 37.47,34.16 39.62,36.32 | 39.62,36.32 43.05,36.32 v43.18,36.45 | 39.61,60.09 39.26,60.09 | U$2.1 66.22,61.14 72.9,67.82 USRF.1 | 39.62,36.32 39.37,36.32 v37.59,38.1
  Bottom 0.813: ICSP.2 5.08,25.4 6.35,24.13 12.7,24.13 v13.97,22.86 | v33.66,73.66 33.66,68.58 JP2.11 35.56,64.14 39.61,60.09 U$2.1 | M1.1 21.59,5.08 20.32,6.35 20.32,10.16 v19.05,11.43 | 39.26,60.09 v35.05,55.88
AREF
  Top 0.254: U1.98 22.94,59.48 C8.1
CELL1  (via drill 0.6)
  Top 0.254: U1.97 23.44,55.7 25.65,57.91 33.02,57.91 33.53,58.42 36.83,58.42 38.1,57.15 48.01,57.15 52.83,52.32 75.69,52.32 76.71,53.34 v76.71,54.61 | v81.53,68.83 v81.53,66.55
  Bottom 0.254: v76.71,54.61 78.23,54.61 81.41,57.78 81.53,57.91 v81.53,66.55 | VBATT.3 82.55,77.22 81.53,76.2 v81.53,68.83
CELL2
  Top 0.254: U1.96 23.94,55.44 25.91,57.4 33.27,57.4 33.78,57.91 36.58,57.91 37.85,56.64 47.75,56.64 52.58,51.82 75.95,51.82 81.03,56.9 81.03,61.47 78.99,63.5 72.64,63.5 71.12,65.02 71.12,66.19 R24.1 R23.1
CELL3
  Top 0.254: U1.95 24.44,55.17 26.16,56.9 33.53,56.9 34.04,57.4 36.32,57.4 37.59,56.13 47.5,56.13 52.32,51.31 76.2,51.31 81.53,56.64 81.53,61.98 79.25,64.26 77.47,64.26 76.81,64.92 R26.2 R25.1
CS  (via drill 0.6)
  Top 0.254: U1.19 16.72,42.72 12.45,46.99 12.45,50.55 v12.7,50.8 | v13.97,56.39 13.97,60.45 15.49,61.98 v15.49,64.26 | U2.3 v7.62,64.52
  Bottom 0.254: v12.7,50.8 12.7,55.12 v13.97,56.39 | v7.62,64.52 15.24,64.52 v15.49,64.26
CTS
  Top 0.254: U$1.12 40.83,66.48 JP2.9
DIN  (via drill 0.5)
  Top 0.254: JP1.8 53.34,82.55 52.7,83.19 52.7,84.77 U$1.3
  Top 0.305: DIN.C 65.41,76.83 59.69,71.12 v53.98,71.12 | v50.8,74.3 50.8,75.56
  Top 0.813: R6.2 31.27,60.81 30.8,61.28 Q3.2 30.96,63.5 32.38,63.5 33.02,64.14 33.02,67.94 34.92,69.85 38.73,69.85 44.45,75.56 50.8,75.56 52.07,75.56 53.34,76.83 JP1.8
  Bottom 0.305: v53.98,71.12 v50.8,74.3
DIO0
  Top 0.254: U$1.20 59.08,62.89 60.96,64.77 JP2.1
DIO1
  Top 0.254: U$1.19 54.83,63.72 55.88,64.77 57.78,64.77 58.42,65.41 JP2.2
DIO2
  Top 0.254: U$1.18 52.83,63.62 JP2.3
DIO3
  Top 0.254: U$1.17 50.83,63.53 52.7,65.41 52.7,66.04 JP2.4
DIO4
  Top 0.254: JP2.10 38.1,62.87 38.73,62.23 38.73,59.98 U$1.11
DIO5
  Top 0.254: U$1.15 46.83,65.25 JP2.6
  Top 0.305: R17.1 66.04,80.01 59.69,73.66 53.34,73.66 48.26,68.58 JP2.6
DIO9
  Top 0.254: U$1.13 42.83,66.33 JP2.8
DIO11
  Top 0.254: JP1.4 43.18,80.01 44.45,81.28 44.45,84.51 U$1.7
DIO12
  Top 0.254: U$1.4 50.83,78.14 JP1.7
DOUT  (via drill 0.5)
  Top 0.254: U$1.2 54.83,79.79 55.88,78.74 JP1.9
  Top 0.305: DOUT.C 65.41,73.03 61.59,69.22 v55.24,69.22
  Top 0.813: R14.2 28.57,84.94 28.57,83.82 28.89,83.5 Q4.2 27.48,81.11 v27.3,81.28
  Bottom 0.305: v55.24,69.22 55.24,74.93 54.61,75.56
  Bottom 0.813: JP1.9 55.88,76.83 54.61,75.56 33.02,75.56 v27.3,81.28
DTR
  Top 0.254: JP1.2 40.64,80.64 40.64,84.7 U$1.9
GND  (via drill 0.5, 0.6)
  Top 0.254: U1.11 18.05,46.72 17.78,46.99 | U1.62 37.6,45.22 38.1,45.72 | U1.32 24.94,35.1 22.23,32.38 | 21.59,55.88 22.01,55.46 22.44,55.46 U1.99 22.44,55.28 21.84,55.88 | 1.8VREG.2 78.23,18.29 | 78.23,18.29 78.23,19.56 | 78.23,18.29 76.96,18.29 74.42,15.75 74.42,14.73 74.38,14.69 U4.17 71.42,14.69 70.87,15.24 U4.4 | U1.81 31.44,55.17 31.24,55.37 v27.94,55.37
  Top 0.305: CSTCE16MOV53-RO16MHZ.2 24.89,27.69 24.89,25.4 25.15,25.15 25.65,25.15
  Top 0.406: U4.3 U4.4 | U4.1 U4.28
  other vias: 14.1,49.66 23.37,17.78 11.94,58.42 23.37,19.05 24.64,19.05 24.64,17.78
  pour Bottom (isolate 0.61): 0.25,88.27 87.43,88.24 88.54,88.24 88.6,0.36 0.46,0.33
  pour Top (isolate 0.406, rank 2): 0.3,88.27 88.44,88.24 88.54,0.36 0.46,0.33
GPS_RX  (via drill 0.6)
  Top 0.254: GPSRX.A 18.41,53.49 18.41,51.44 18.63,51.22 U1.2 23.71,51.22 v24.13,50.8 | v26.67,50.8 33.02,50.8 35.56,53.34 35.56,54.1 36.07,54.61 45.47,54.61 v48.26,51.82 | SERIAL0.2 85.04,24.84 79.1,30.79 79.1,41.91 72.24,48.77 v69.95,48.77
  Bottom 0.254: v24.13,50.8 v26.67,50.8 | U$2.3 71.32,58.11 65.81,52.6 | 65.81,52.6 65.53,52.32 48.77,52.32 v48.26,51.82 | v69.95,48.77 69.65,48.77 65.81,52.6
GPS_TX  (via drill 0.6)
  Top 0.254: GPSTX.A 16.51,52.45 18.24,50.72 U1.3 21.67,50.72 22.86,49.53 v24.13,49.53 | v26.67,49.53 v33.66,49.53 | SERIAL0.1 82.88,19.07 81.99,19.96 81.99,26.06 77.57,30.48 77.57,41 v72.85,45.72 | v72.08,54.71 71.52,54.71 68.78,57.45 U$2.2
  Bottom 0.254: v24.13,49.53 v26.67,49.53 | v33.66,49.53 34.29,49.53 34.92,50.16 34.92,52.83 35.43,53.34 64.77,53.34 68.78,57.35 U$2.2 | v72.85,45.72 72.85,53.95 v72.08,54.71
MISO
  Top 0.254: U1.22 18.36,41.22 15.24,38.1 ICSP.9 7.62,39.37 2.54,44.45 2.54,67.94 5.71,71.12 5.71,73.03 4.45,74.3 4.45,81.92 5.28,82.75 U3.7
MOSI  (via drill 0.5)
  Top 0.254: U1.21 12.89,41.72 v12.7,41.91 10.79,41.91 6.35,46.35 6.35,58.42 8.89,60.96 9.53,60.96 10.16,61.59 U2.5
  Bottom 0.813: ICSP.1 10.16,27.94 12.7,30.48 v12.7,41.91
N$1
  Top 0.813: 3V3_PWR.C 23.01,72.46 R3.2
N$2
  Top 0.254: 1.8VREG.4 79.18,22.41 C4.1
N$3
  Top 0.254: U2.2 6.35,65.41 7.62,66.67 14.61,66.67 15.88,67.94 15.88,69.22 14.61,70.48 12.06,70.48 8.89,73.66 8.89,76.83 8.47,77.25 U3.2
N$4
  Top 0.254: U3.3 8.64,78.35 9.53,77.47 9.53,74.3 12.7,71.12 15.24,71.12 16.51,69.85 16.51,67.31 15.24,66.04 9.53,66.04 8.89,65.41 U2.4
N$5
  Top 0.254: U2.6 11.43,64.77 12.06,65.41 15.88,65.41 17.14,66.67 17.14,70.48 15.88,71.75 13.97,71.75 10.79,74.93 10.79,80.01 10.26,80.55 U3.5
N$6
  Top 0.254: U4.16 78.06,14.14 C5.1
N$7
  Top 0.254: 5_PWR.C 43.23,51.53 R4.2
N$8
  Top 0.813: R17.2 DIO5.A
N$9
  Top 0.813: R18.2 RSSI.A
N$10
  Top 0.813: DIN.A R16.2
N$11
  Top 0.813: DOUT.A R15.2
N$12
  Top 0.254: JP1.6 48.26,84.32 U$1.5
N$13
  Top 0.254: C5.2 78.23,11.18 72.14,11.18 71.63,11.68 71.63,12.9 U4.12
N$14
  Top 0.254: U4.15 75.44,13.59 C6.1
N$16
  Top 0.254: U4.20 73.34,16.26 72.14,16.26 71.67,16.72 U4.24 71.67,18.5 70.87,19.3 69.09,19.3 68.83,19.05 62.87,19.05 | R2.1 62.87,19.05 | 62.87,19.05 62.87,20.42 Q5.2
N$17  (via drill 0.6)
  Top 0.254: U4.19 71.84,15.79 71.12,16.51 U4.25 71.12,18.29 70.87,18.54 68.83,18.54 68.58,18.29 66.55,18.29 v66.04,17.78 | Q6.2 56.98,21.25 59.18,19.05 | 59.18,19.05 59.18,17.55 R19.1 | 59.18,19.05 v59.69,19.05
  Bottom 0.254: v66.04,17.78 60.96,17.78 v59.69,19.05
N$18
  Top 0.254: R23.2 73.56,70 74.93,71.37 81.79,71.37 82.04,71.63 82.04,74.17 82.55,74.68 VBATT.2
N$19
  Top 0.254: U5.14 51.63,43.62 51.31,43.94 49.78,43.94 49.4,44.33 C10.1 C7.1
N$20
  Top 0.254: C7.2 52.05,48.16 R22.1
N$21
  Top 0.254: VBATT.1 83.06,70.1 80.16,70.1 R25.2
PWM1  (via drill 0.5)
  Top 0.254: U1.5 18.23,49.72 10.16,57.78 v9.53,57.78
  Bottom 0.813: M1.3 24.13,11.43 17.14,18.41 17.14,41.91 13.97,45.09 8.26,45.09 6.99,46.35 6.99,57.15 7.62,57.78 v9.53,57.78
PWM2  (via drill 0.5)
  Top 0.254: U1.6 17.45,49.22 10.16,56.52 v8.89,56.52
  Bottom 0.813: M2.3 27.94,10.16 19.05,19.05 19.05,41.91 14.61,46.35 10.16,46.35 8.89,47.62 v8.89,56.52
PWM3  (via drill 0.5)
  Top 0.254: U1.7 16.68,48.72 12.06,53.34 v10.79,53.34
  Bottom 0.813: M3.3 34.29,10.79 27.18,17.91 27.18,23.11 20.95,29.34 20.95,41.91 15.24,47.62 11.43,47.62 10.79,48.26 v10.79,53.34
PWM4  (via drill 0.5)
  Top 0.254: U1.15 22.59,44.72 v22.86,44.45
  Bottom 0.813: M4.3 39.37,12.06 28.96,22.48 28.96,23.62 22.86,29.72 v22.86,44.45
PWM5  (via drill 0.5)
  Top 0.254: U1.16 21.82,44.22 22.86,43.18 v24.77,43.18
  Bottom 0.813: M5.3 44.45,13.34 43.18,14.61 43.05,14.48 42.42,14.48 24.77,32.13 v24.77,43.18
PWM6  (via drill 0.5)
  Top 0.254: U1.17 21.05,43.72 22.86,41.91 v26.67,41.91
  Bottom 0.813: M6.3 49.53,12.7 45.47,16.76 42.67,16.76 26.67,32.77 v26.67,41.91
PWM7  (via drill 0.5)
  Top 0.254: U1.39 28.44,34.42 v29.08,33.78
  Bottom 0.813: M7.3 54.61,12.06 47.62,19.05 43.69,19.05 29.08,33.66 v29.08,33.78
PWM8  (via drill 0.6)
  Top 0.254: U1.38 27.94,35.56 27.3,34.92 27.3,33.02 27.94,32.38 30.73,32.38
  Top 0.305: 30.73,32.38 31.24,32.89 v31.24,34.29
  Bottom 0.813: M8.3 49.02,20.83 44.7,20.83 v31.24,34.29
R_LED_GPS
  Top 0.813: R1.2 19.2,57.78 GPSRX.C GPSTX.C
RES1
  Top 0.254: JP1.3 40.64,78.74 43.18,81.28 43.18,81.54 U$1.8
RES2
  Top 0.254: U$1.14 44.83,65.78 JP2.7
RESET
  Top 0.254: U1.30 23.94,36.64 17.78,30.48 16,30.48 | 16,30.48 10.16,30.48 | C9.1 16,27.43 16,30.48
  Top 0.813: RESET.1 RESET.2 7.77,15.82 R10.1 7.77,21.59 D1.A 8.05,24.56 10.16,26.67 10.16,30.48 10.16,31.75 8.89,33.02 ICSP.5
RSSI  (via drill 0.5)
  Top 0.254: U$1.6 46.83,79.85 45.72,78.74 JP1.5
  Top 0.305: R18.1 67.94,83.82 v66.67,85.09
  Bottom 0.305: v66.67,85.09 51.44,85.09 45.72,79.38 JP1.5
RTS
  Top 0.254: U$1.16 48.92,62.89 50.8,64.77 JP2.5
SCK  (via drill 0.5)
  Top 0.254: U1.20 13.66,42.22 12.7,43.18 v11.43,43.18 6.99,47.62 6.99,57.15 10.79,60.96 12.06,60.96 12.7,61.59 U2.7
  Bottom 0.813: ICSP.7 10.16,35.56 11.43,36.83 v11.43,43.18
SCL3V3  (via drill 0.6)
  Top 0.254: Q2.2 37.38,26.2 40.39,29.21 40.39,30.48 v40.64,30.73 | U5.2 47.57,41.22 v46.99,40.64 46.27,41.36 BMP085.6
  Top 0.305: Q2.2 35.24,22.7 R9.2
  Bottom 0.254: v40.64,30.73 40.64,31.5 46.74,37.59 46.74,40.39 v46.99,40.64
SCL5V  (via drill 0.6)
  Top 0.254: U1.43 30.44,35.85 30.73,35.56 32.77,35.56 33.02,35.31 33.02,33.02 | R20.1 55.78,17.42 v57.15,18.8 | Q5.3 60.11,23.45 v59.44,24.13 | Q2.3 37.3,28.41 v38.61,29.72
  Top 0.305: Q2.3 34.29,29.21 33.02,30.48 33.02,31.6 R11.2 33.02,31.9 33.02,33.02
  Bottom 0.254: v59.44,24.13 60.45,23.11 60.45,22.1 57.4,18.8 v57.15,18.8 56.13,17.78 54.1,17.78 49.78,22.1 45.72,22.1 38.61,29.21 v38.61,29.72
SDA3V3  (via drill 0.6)
  Top 0.254: v45.47,26.92 44.75,26.2 Q1.2 42.86,22.7 R13.2 | U5.3 48.44,40.57 48.26,40.39 48.26,36.83 v46.48,35.05 | BMP085.7 44.41,42.63 v45.97,44.2
  Bottom 0.254: v45.47,26.92 45.47,34.04 v46.48,35.05 49.02,37.59 49.02,40.13 45.97,43.18 v45.97,44.2
SDA5V
  Top 0.254: U1.44 30.99,37.67 30.99,36.58 31.24,36.32 38.86,36.32 39.88,35.31 39.88,33.81 R12.1 39.85,32.79 40.64,32 41.66,32 41.91,31.75 Q1.3 48.56,28.41 51.56,25.4 51.56,23.37 | R21.1 52.2,19.68 51.56,20.32 51.56,23.37 | Q6.3 54.02,23.37 51.56,23.37
USRF_AN_OUT
  Top 0.254: U1.94 24.94,54.91 26.42,56.39 33.78,56.39 34.29,56.9 36.07,56.9 37.34,55.63 47.24,55.63 52.07,50.8 76.45,50.8 82.04,56.39 82.04,64.01 83.31,65.28 USRF.2
XB_RX  (via drill 0.5)
  Top 0.254: U1.45 31.44,40.31 v29.84,41.91
  Top 0.813: Q4.3 29.84,77.47 28.57,76.2 28.57,73.81 R7.1 27.3,73.66 26.04,72.39 26.04,66.67 v27.43,65.28
  Bottom 0.813: v29.84,41.91 29.84,62.87 v27.43,65.28
XB_TX  (via drill 0.5)
  Top 0.254: U1.46 31.94,41.72 v31.75,41.91
  Top 0.813: Q3.3 29.84,66.67 | 29.84,66.67 28.57,67.94 28.57,70.33 R5.1 | 29.84,66.67 v30.48,67.31
  Bottom 0.813: v31.75,41.91 31.75,66.04 v30.48,67.31
XTAL1
  Top 0.254: U1.34 25.94,30.73 R8.1 25.77,30.06 CSTCE16MOV53-RO16MHZ.3
XTAL2
  Top 0.254: U1.33 25.4,37.68 25.4,33.02 23.34,30.96 R8.2 23.34,27.73 CSTCE16MOV53-RO16MHZ.1

### Text on the board
tPlace: front | BMP085 | Y | Z | X | LSM303DLHC | OSQ | Control Board V3.0 | April 2014